# Altium schematic sheet Sheet1.SchDoc
size A3
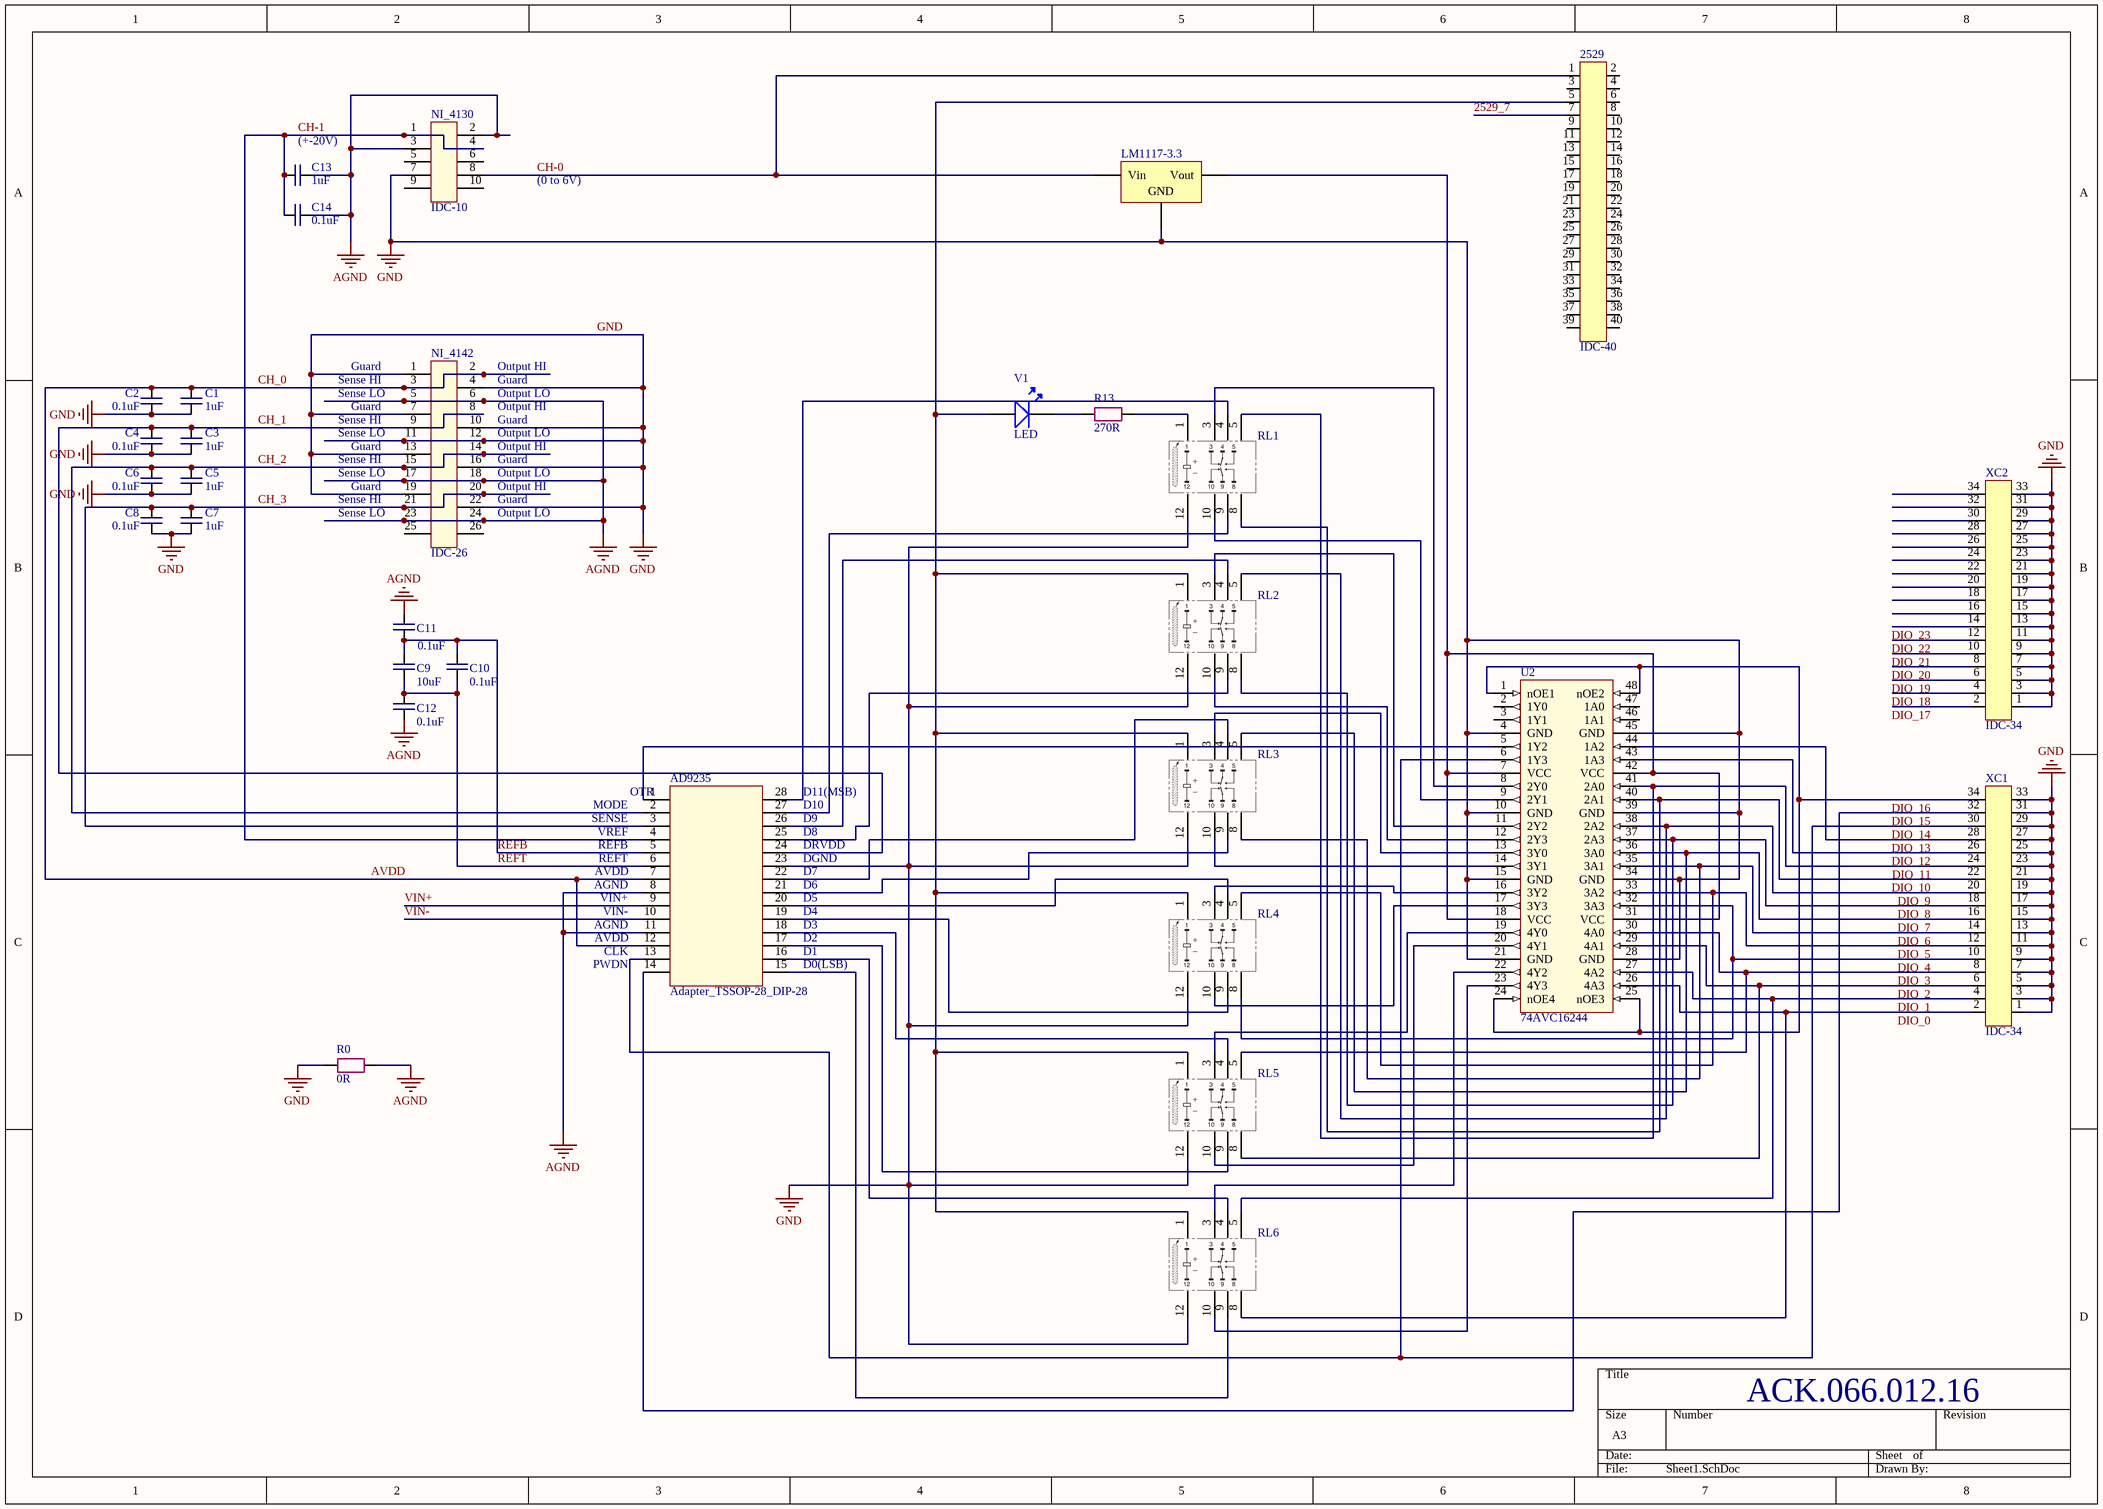
[diagram p0: Sheet1.SchDoc]

## Parts
2529  IDC-40  [IDC-40]
AD9235  Adapter_TSSOP-28_DIP-28  [Adapter_TSSOP-28_DIP-28 - 14mm]
C1  1uF  [C_0805]
C2  0.1uF  [C_0805]
C3  1uF  [C_0805]
C4  0.1uF  [C_0805]
C5  1uF  [C_0805]
C6  0.1uF  [C_0805]
C7  1uF  [C_0805]
C8  0.1uF  [C_0805]
C9  10uF  [C_0805]
C10  0.1uF  [C_0805]
C11  0.1uF  [C_0805]
C12  0.1uF  [C_0805]
C13  1uF  [C_0805]
C14  0.1uF  [C_0805]
LM1117-3.3  LM1117-3.3  [D2PAK_N]  (value not drawn)
NI_4130  IDC-10  [IDC-10]
NI_4142  IDC-26  [IDC-26]
R0  0R  [R_0805]
R13  270R  [R_0805]
RL1  Relay_G6S-2  [Relay_G6S-2]  (value not drawn)
RL2  Relay_G6S-2  [Relay_G6S-2]  (value not drawn)
RL3  Relay_G6S-2  [Relay_G6S-2]  (value not drawn)
RL4  Relay_G6S-2  [Relay_G6S-2]  (value not drawn)
RL5  Relay_G6S-2  [Relay_G6S-2]  (value not drawn)
RL6  Relay_G6S-2  [Relay_G6S-2]  (value not drawn)
U2  74AVC16244  [74AVC16244]
V1  LED  [LED]
XC1  IDC-34  [IDC-34]
XC2  IDC-34  [IDC-34]

## Nets
AGND: AD9235.8 AD9235.11 C11.2 C12.1 C13.2 C14.2 NI_4130.2 NI_4130.3 NI_4142.5 NI_4142.6 NI_4142.17 NI_4142.18 NI_4142.23 NI_4142.24 R0.1
GND: AD9235.23 C1.2 C2.2 C3.2 C4.2 C5.2 C6.2 C7.2 C8.2 LM1117-3.3.2(GND) NI_4130.7 NI_4142.1 NI_4142.4 NI_4142.7 NI_4142.10 NI_4142.11 NI_4142.12 NI_4142.13 NI_4142.16 NI_4142.19 NI_4142.22 R0.2 RL1.12 RL2.12 RL3.12 RL4.12 RL5.12 RL6.12 U2.4(GND) U2.10(GND) U2.15(GND) U2.21(GND) U2.28(GND) U2.34(GND) U2.39(GND) U2.45(GND) XC1.1 XC1.3 XC1.5 XC1.7 XC1.9 XC1.11 XC1.13 XC1.15 XC1.17 XC1.19 XC1.21 XC1.23 XC1.25 XC1.27 XC1.29 XC1.31 XC1.33 XC2.1 XC2.3 XC2.5 XC2.7 XC2.9 XC2.11 XC2.13 XC2.15 XC2.17 XC2.19 XC2.21 XC2.23 XC2.25 XC2.27 XC2.29 XC2.31 XC2.33
2529_7: 2529.7
AVDD: AD9235.7 AD9235.12 C1.1 C2.1 NI_4142.2 NI_4142.3  [also labelled CH_0]
CH-0: 2529.1 LM1117-3.3.1(Vin) NI_4130.8
CH-1: AD9235.4 C13.1 C14.1 NI_4130.1 NI_4130.4
CH_1: AD9235.24 C3.1 C4.1 NI_4142.9
CH_2: AD9235.2 C5.1 C6.1 NI_4142.14 NI_4142.15
CH_3: AD9235.3 C7.1 C8.1 NI_4142.20 NI_4142.21
DIO_0: RL6.8 U2.26(4A3) XC1.2
DIO_1: RL6.5 U2.27(4A2) XC1.4
DIO_2: RL5.8 U2.29(4A1) XC1.6
DIO_3: RL5.5 U2.30(4A0) XC1.8
DIO_4: RL4.8 U2.32(3A3) XC1.10
DIO_5: RL4.5 U2.33(3A2) XC1.12
DIO_6: RL3.8 U2.35(3A1) XC1.14
DIO_7: RL3.5 U2.36(3A0) XC1.16
DIO_8: RL2.8 U2.37(2A3) XC1.18
DIO_9: RL2.5 U2.38(2A2) XC1.20
DIO_10: RL1.8 U2.40(2A1) XC1.22
DIO_11: RL1.5 U2.41(2A0) XC1.24
DIO_12: U2.43(1A3) XC1.26
DIO_13: U2.44(1A2) XC1.28
DIO_14: AD9235.13 U2.6(1Y3) XC1.30
DIO_15: AD9235.14 XC1.32
DIO_16: U2.1(nOE1) U2.24(nOE4) U2.25(nOE3) U2.48(nOE2) XC1.34
DIO_17: XC2.2
DIO_18: XC2.4
DIO_19: XC2.6
DIO_20: XC2.8
DIO_21: XC2.10
DIO_22: XC2.12
DIO_23: XC2.14
REFB: AD9235.5 C9.2 C10.2 C11.1
REFT: AD9235.6 C9.1 C10.1 C12.2
VIN+: AD9235.9
VIN-: AD9235.10
Net2529_5: 2529.5 RL2.1 RL3.1 RL4.1 RL5.1 RL6.1 V1.1
NetAD9235_1: AD9235.1 U2.5(1Y2)
NetAD9235_15: AD9235.15 RL6.9
NetAD9235_16: AD9235.16 RL6.4
NetAD9235_17: AD9235.17 RL5.9
NetAD9235_18: AD9235.18 RL5.4
NetAD9235_19: AD9235.19 RL4.9
NetAD9235_20: AD9235.20 RL4.4
NetAD9235_21: AD9235.21 RL3.9
NetAD9235_22: AD9235.22 RL3.4
NetAD9235_25: AD9235.25 RL2.9
NetAD9235_26: AD9235.26 RL2.4
NetAD9235_27: AD9235.27 RL1.9
NetAD9235_28: AD9235.28 RL1.4
NetLM1117-3.3_3: LM1117-3.3.3(Vout) U2.7(VCC) U2.18(VCC) U2.31(VCC) U2.42(VCC)
NetR13_1: R13.1 RL1.1
NetR13_2: R13.2 V1.2
NetRL1_3: RL1.3 U2.8(2Y0)
NetRL1_10: RL1.10 U2.9(2Y1)
NetRL2_3: RL2.3 U2.11(2Y2)
NetRL2_10: RL2.10 U2.12(2Y3)
NetRL3_3: RL3.3 U2.13(3Y0)
NetRL3_10: RL3.10 U2.14(3Y1)
NetRL4_3: RL4.3 U2.16(3Y2)
NetRL4_10: RL4.10 U2.17(3Y3)
NetRL5_3: RL5.3 U2.19(4Y0)
NetRL5_10: RL5.10 U2.20(4Y1)
NetRL6_3: RL6.3 U2.22(4Y2)
NetRL6_10: RL6.10 U2.23(4Y3)

Not connected (* = marked no-connect by the designer): 2529 2 3 4 6 8 9 10 11 12 13 14 15 16 17 18 19 20 21 22 23 24 25 26 27 28 29 30 31 32 33 34 35 36 37 38 39 40; NI_4130 5 6 9 10; NI_4142 8 25 26; U2 2(1Y0) 3(1Y1) 46(1A1) 47(1A0); XC2 16 18 20 22 24 26 28 30 32 34

## Notes on the sheet
- (near C13) (+-20V)
- (0 to 6V)
- (near NI_4142) Sense HI
- (near NI_4142) Guard
- (near NI_4142) Output HI
- (near NI_4142) Sense LO
- (near NI_4142) Output LO
- (near AD9235) OTR
- (near AD9235) MODE
- (near AD9235) SENSE
- (near AD9235) VREF
- (near AD9235) REFB
- (near AD9235) D8
- (near AD9235) D9
- (near AD9235) D10
- (near AD9235) D11(MSB)
- (near AD9235) DRVDD
- (near AD9235) REFT
- (near AD9235) AVDD
- (near AD9235) AGND
- (near AD9235) VIN+
- (near AD9235) VIN-
- (near AD9235) D4
- (near AD9235) D5
- (near AD9235) D6
- (near AD9235) D7
- (near AD9235) DGND
- (near AD9235) CLK
- (near AD9235) PWDN
- (near AD9235) D0(LSB)
- (near AD9235) D1
- (near AD9235) D2
- (near AD9235) D3
- ACK.066.012.16

## Library data of the parts
2529 = IDC-40: разъем 2529
AD9235 = Adapter_TSSOP-28_DIP-28: from aliexpress
C1-C14 = capacitor 0805
LM1117-3.3 = Volt Reg: Voltage Regulator; Published: 24-Mar-1999; LatestRevisionDate: 29-May-2009; LatestRevisionNote: IPC-7351 Footprint Added.; PackageReference: D2PAK; Publisher: Altium Limited; PackageDescription: 3-Pin Transistor Outline Package 2.54 mm Pitch, 15.1 mm Lead Span
NI_4130 = IDC-10: разъем 4130
NI_4142 = IDC-26: разъем 4142
R0 R13 = resistor 0805